# EAGLE design multi-switches (EAGLE 7.1.0)
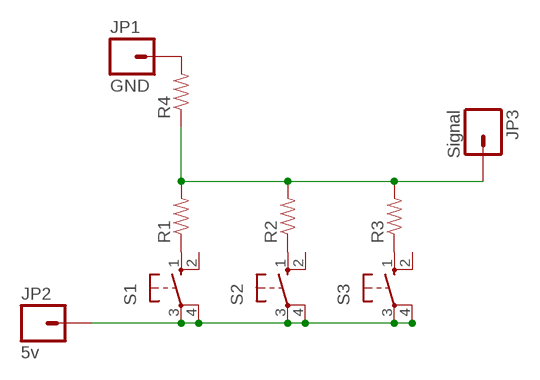
[diagram p0: schematic, sheet 1]

## Parts
JP1  GND  M01PTH_LONGPAD  [1X01_LONGPAD]
JP2  5v  M01PTH_LONGPAD  [1X01_LONGPAD]
JP3  Signal  M01PTH_LONGPAD  [1X01_LONGPAD]
R1  RESISTOR1206  [1206]
R2  RESISTOR1206  [1206]
R3  RESISTOR1206  [1206]
R4  RESISTOR1206  [1206]
S1  10-XX  [B3F-10XX]
S2  10-XX  [B3F-10XX]
S3  10-XX  [B3F-10XX]

## Nets
N$1: JP1.1 R4.2
N$2: R1.1 S1.1(S)
N$3: R2.1 S2.1(S)
N$4: R3.1 S3.1(S)
N$5: JP3.1 R1.2 R2.2 R3.2 R4.1
N$7: JP2.1 S1.3(P) S1.4(P1) S2.3(P) S2.4(P1) S3.3(P) S3.4(P1)
Unconnected: S1.2(S1) S2.2(S1) S3.2(S1)

## Library data of the parts
JP1-JP3 = SparkFun-Connectors:M01: Header 1 Standard 1-pin 0.1" header. Use with straight break away headers (SKU : PRT-00116), right angle break away headers (PRT-00553), swiss pins (PRT-00743), machine pins (PRT-00117), and female headers (PRT-00115).
R1-R4 = SparkFun-Passives:RESISTOR: Resistor Basic schematic elements and footprints for 0603, 1206, and PTH resistors.
S1-S3 = switch-omron:10-XX: OMRON SWITCH; MPN: B3F-1000; OC_FARNELL: 176432; OC_NEWARK: 36M3542

## Board
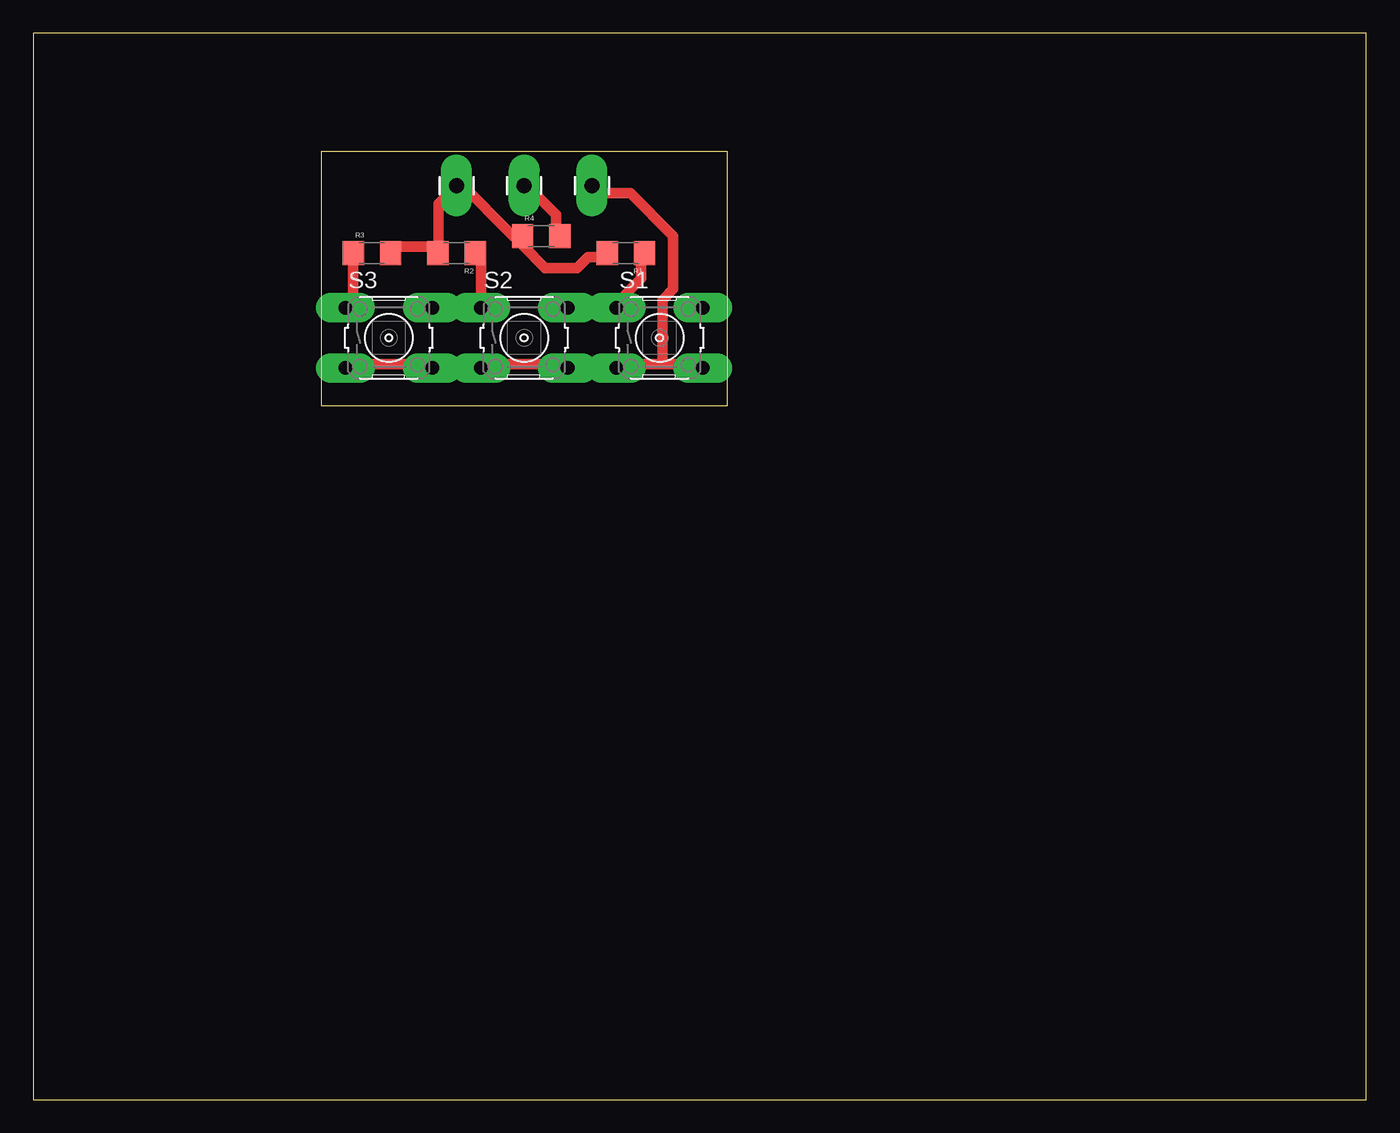
[diagram p1: board, top side]

Size 100 x 80 mm. Coordinates in mm from the lower left corner, seen from the top.
Outline: 0,0 100,0 100,80 0,80 0,0
Copper layers (1*16): Top 0.035mm / dielectric 1.5mm / Bottom 0.035mm
Design rules "make": minimum track width 0.8mm, minimum drill 0.8mm, track to track 0.8mm, track to pad 0.8mm, pad to pad 0.45mm, via to via 0.8mm, smd to smd 8mil, copper to edge 10mil, drill to drill 8mil, minimum pad ring 0.6mm, minimum via ring 0.6mm, stop-mask expansion 0mil, vias tented up to drill 0mil, thermal gap 10mil

### Footprints (pad centres in the part's own frame; a part is rotated, then mirrored left to right if it is on the bottom)
1X01_LONGPAD = drill 1.118 pad 1.88 long: 1 0,0
1206 = smd 1.6 x 1.8: 1 -1.4,0; 2 1.4,0
B3F-10XX = drill 1.016 long: 1 -3.251,2.261; 2 3.251,2.261; 3 -3.251,-2.261; 4 3.251,-2.261

### Placement (x,y rotation side)
JP1  36.83,68.58 0 top
JP2  41.91,68.58 0 top
JP3  31.75,68.58 0 top
R1  44.45,63.5 180 top
R2  31.75,63.5 180 top
R3  25.4,63.5 0 top
R4  38.1,64.77 0 top
S1  46.99,57.15 0 top
S2  36.83,57.15 0 top
S3  26.67,57.15 0 top

### Tracks (layer width: path | path; a pad name or v marks a point on that pad's centre or on a via)
N$1
  Top 0.8: R4.2 39.2,64.8 39.2,66.4 37.6,68 JP1.1
N$2
  Top 0.8: R1.1 45.6,63.2 45.6,61.6 44,60 S1.1
N$3
  Top 0.8: R2.1 33.6,63.2 33.6,60 S2.1
N$4
  Top 0.8: R3.1 24,60 S3.1
N$5
  Top 0.8: R3.2 27.2,64 29.6,64 R2.2 30.4,64 30.4,67.2 31.2,68 JP3.1 32,68.8 36,64.8 R4.1 36.8,64 38.4,62.4 40.8,62.4 41.6,63.2 42.4,63.2 R1.2
N$7
  Top 0.8: S3.3 24,55.2 29.6,55.2 S3.4 30.4,55.2 32.8,55.2 S2.3 33.6,55.2 40,55.2 S2.4 40.8,55.2 43.2,55.2 S1.3 44,55.2 47.2,55.2 | 47.2,55.2 49.6,55.2 S1.4 | 47.2,55.2 47.2,60 48,60.8 48,64.8 44.8,68 42.4,68 JP2.1